# EasyEDA Pro project ProProject_J-Link OB-RA4M2_20230930_V1.0.epro

# Schematic J-Link OB-RA4M2
Create Date: 2023-09-28; Page Name: P1; Project Name: J-Link OB-RA4M2; Schematic Name: J-Link OB-RA4M2; Update Date: 2023-09-29; Company: 嘉立创EDA; Page Size: A4; Version: V1.0
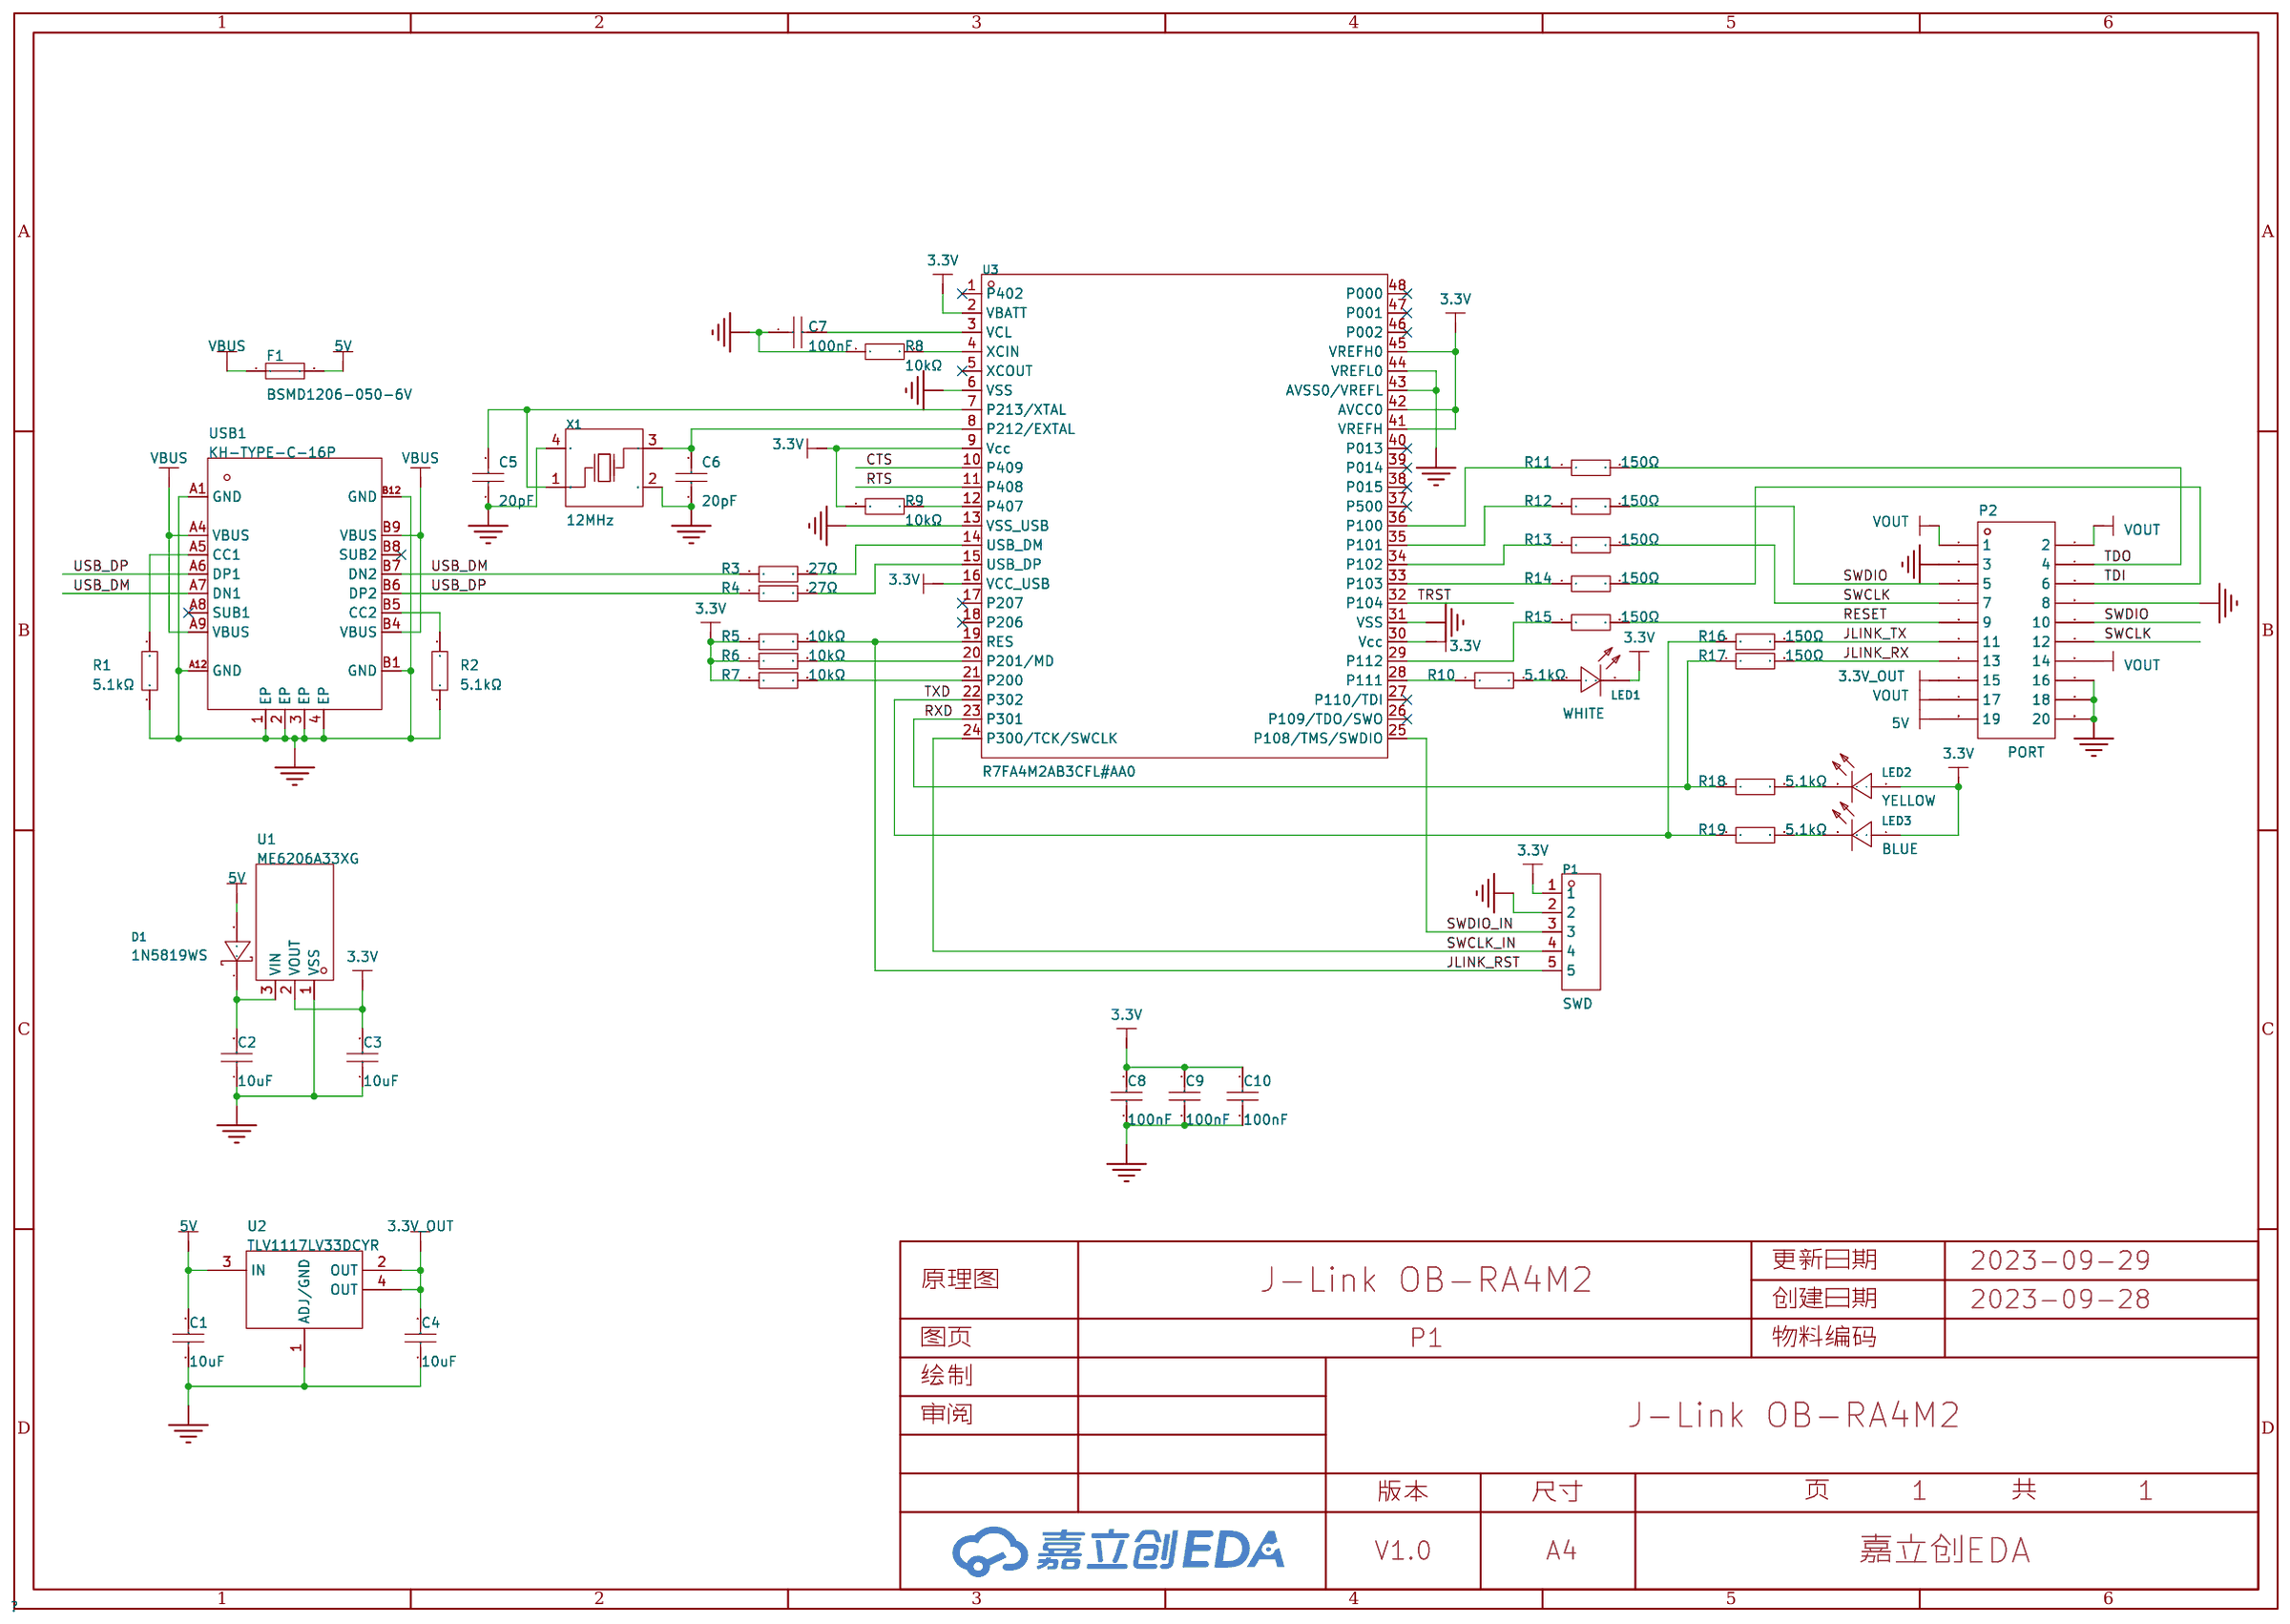
[diagram p0: schematic sheet]

## Parts
C1  10uF  [C0805]
C2  10uF  [C0805]
C3  10uF  [C0805]
C4  10uF  [C0805]
C5  20pF  [C0603]
C6  20pF  [C0603]
C7  100nF  [C0603]
C8  100nF  [C0603]
C9  100nF  [C0603]
C10  100nF  [C0603]
D1  1N5819WS  [SOD-323_L1.8-W1.3-LS2.5-RD]
F1  BSMD1206-050-6V  [F1206]
LED1  WHITE  [LED0603-RD]
LED2  YELLOW  [LED0603-RD-YELLOW]
LED3  BLUE  [LED0603-RD]
P1  SWD  [HDR-TH_5P-P2.54-V-M]
P2  PORT  [HDR-SMD_20P-P2.54]
R1  5.1kΩ  [R0603]
R2  5.1kΩ  [R0603]
R3  27Ω  [R0603]
R4  27Ω  [R0603]
R5  10kΩ  [R0603]
R6  10kΩ  [R0603]
R7  10kΩ  [R0603]
R8  10kΩ  [R0603]
R9  10kΩ  [R0603]
R10  5.1kΩ  [R0603]
R11  150Ω  [R0603]
R12  150Ω  [R0603]
R13  150Ω  [R0603]
R14  150Ω  [R0603]
R15  150Ω  [R0603]
R16  150Ω  [R0603]
R17  150Ω  [R0603]
R18  5.1kΩ  [R0603]
R19  5.1kΩ  [R0603]
U1  ME6206A33XG  [SOT-23-3_L2.9-W1.6-P1.90-LS2.8-BR]
U2  TLV1117LV33DCYR  [SOT-223_L6.7-W3.5-P2.30-BR]
U3  R7FA4M2AB3CFL#AA0  [LQFP-48_L7.0-W7.0-P0.50-LS9.0-BL]
USB1  KH-TYPE-C-16P  [USB-C-SMD_KH-TYPE-C-16P]
X1  12MHz  [OSC-SMD_4P-L3.2-W2.5-BL]

## Library data of the parts
C1-C4 = CL21A106KAYNNNE_C15850: 容值:10uF;精度:±10%;额定电压:25V;材质(温度系数):X5R;; LCSC Part Name: 10uF ±10% 25V; Supplier Part: C15850; Manufacturer: SAMSUNG(三星); Manufacturer Part: CL21A106KAYNNNE; Supplier Footprint: 0805; JLCPCB Part Class: 基础库; Datasheet: https://atta.szlcsc.com/upload/public/pdf/source/20160103/1457707679302.pdf; Supplier: LCSC; Tolerance: ±10%; Voltage Rated: 25V; Temperature Coefficient: X5R
C5 C6 = CL10C200JB8NNNC: 容值:20pF;精度:±5%;额定电压:50V;材质(温度系数):C0G;; LCSC Part Name: 20pF ±5% 50V; Supplier Part: C1648; Manufacturer: SAMSUNG(三星); Supplier Footprint: 0603; JLCPCB Part Class: Basic Part; Datasheet: https://atta.szlcsc.com/upload/public/pdf/source/20160103/1457707686863.pdf; Supplier: LCSC; Tolerance: ±5%; Voltage Rated: 50V; Temperature Coefficient: C0G
C7-C10 = 0603B104K500NT: 容值:100nF;精度:±10%;额定电压:50V;材质(温度系数):X7R;; LCSC Part Name: 100nF ±10% 50V; Supplier Part: C30926; Manufacturer: FH(风华); Supplier Footprint: 0603; JLCPCB Part Class: Extended Part; Datasheet: https://atta.szlcsc.com/upload/public/pdf/source/20170923/C30926_1506149436298988724.pdf; Supplier: LCSC; Tolerance: ±10%; Voltage Rated: 50V; Temperature Coefficient: X7R
D1 = 1N5819WS_C191023: 直流反向耐压(Vr):40V;平均整流电流(Io):1A;正向压降(Vf):600mV@1A;; LCSC Part Name: 40V 1A 600mV@1A; Supplier Part: C191023; Manufacturer: Hottech(合科泰); Supplier Footprint: SOD-323; JLCPCB Part Class: 基础库; Datasheet: https://atta.szlcsc.com/upload/public/pdf/source/20220428/3CB86FD8D28D653594B4E35F9D5AEFD9.pdf; Supplier: LCSC; Reverse Voltage (Vr): 40V; Average Rectified Current (Io): 1A; Forward Voltage (Vf@If): 600mV@1A
F1 = BSMD1206-050-6V: 最大电压:6V;最大电流:100A;保持电流:500mA;跳闸电流:1A;; LCSC Part Name: 6V 500mA 1206自恢复 100毫秒内动作; Supplier Part: C883122; Manufacturer: BHFUSE(佰宏); Supplier Footprint: 1206; JLCPCB Part Class: 扩展库; Datasheet: https://atta.szlcsc.com/upload/public/pdf/source/20220607/BE3D288249A8A8FEF08AA69BF9FC830E.pdf; Supplier: LCSC; Operating Voltage (Max): 6V; Current Rating (Max): 100A; Hold Current: 500mA; Trip Current: 1A; Power Dissipation: 600mW; Resistance - Initial (Ri) (Min): 150mΩ; Resistance - Post Trip (R1) (Max): 700mΩ; Maximum Time to Trip: 100ms; Operating Temperature: -40℃~+85℃
LED1 = 19-217/T1D-CQ2R2TY/3T: 发光颜色:白灯;; LCSC Part Name: 白灯; Supplier Part: C83955; Manufacturer: EVERLIGHT(亿光); Supplier Footprint: 0603; JLCPCB Part Class: Extended Part; Datasheet: https://atta.szlcsc.com/upload/public/pdf/source/20161024/1477288583901.pdf; Supplier: LCSC; Emitted Color: 白灯
LED2 = 19-213/Y2C-CQ2R2L/3T(CY): 发光颜色:黄灯;二极管配置:-;主波长:585.5nm~591.5nm;色温:-;功率:60mW;安装方式:-;; LCSC Part Name: 黄灯; Supplier Part: C72038; Manufacturer: EVERLIGHT(亿光); Supplier Footprint: 0603; JLCPCB Part Class: Basic Part; Datasheet: https://atta.szlcsc.com/upload/public/pdf/source/20160507/1462613613586.pdf; Supplier: LCSC; Emitted Color: 黄灯; Lens Color: 无色透明; Dominant Wavelength: 585.5nm~591.5nm; Peak Wavelength: 591nm; Forward Current: 20mA; Power Dissipation: 60mW; Viewing Angle: 120°; Operating Temperature: -40℃~+85℃
LED3 = 19-217/BHC-XL2M2TY/3T: 发光颜色:蓝灯;; LCSC Part Name: 蓝灯; Supplier Part: C264464; Manufacturer: EVERLIGHT(亿光); Supplier Footprint: 0603; JLCPCB Part Class: Extended Part; Datasheet: https://atta.szlcsc.com/upload/public/pdf/source/20180817/C264464_B6CF2C98FB6ABB846DE0D80D033E0DA6.pdf; Supplier: LCSC; Emitted Color: 蓝灯; Lens Color: 无色透明; Dominant Wavelength: 465nm~475nm; Peak Wavelength: 468nm; Forward Current: 5mA; Power Dissipation: 110mW; Viewing Angle: 120°; Operating Temperature: -40℃~+85℃
P1 = PZ254V-11-05P: 排数:单排;总PIN位数:5P;间距:2.54mm;插针结构:1x5P;行距:-;安装类型:直插;圆针/方针:方针;额定电流:-;额定电压:-;配合针长度:6mm;塑高:2.5mm;端接针长度:3mm;触头材质:黄铜;触头镀层:-;工作温度范围:-40℃~+105℃;颜色:黑色;; LCSC Part Name: 2.54mm 1x5P 直插 方针; Supplier Part: C492404; Manufacturer: XFCN(兴飞); Supplier Footprint: 插件,P=2.54mm; JLCPCB Part Class: Extended Part; Datasheet: https://atta.szlcsc.com/upload/public/pdf/source/20200309/C492404_E51533260F8710EFF5D4617281164C1D.pdf; Supplier: LCSC; Number of Rows: 单排; Number of Pins: 5P; Pitch: 2.54mm; Pin Structure: 1x5P; Mounting Type: 直插; Circluar Pins/Square Pins: 方针; Length of Mating Pin: 6mm; Insulation Height: 2.5mm; Length of End Connection Pin: 3mm; Contact Material: 黄铜; Operating Temperature Range: -40℃~+105℃; Color: 黑色
P2 = HDR2x10_SMD: 间距:2.54mm;总PIN位数:20;排数:2;插针结构:2x10P;行距:2.54mm;安装类型:直插;圆针/方针:-;额定电流:-;额定电压:-;配合针长度:6mm;塑高:2.54mm;端接针长度:3mm;触头材质:黄铜;触头镀层:-;工作温度范围:-40~+105;颜色:黑色;; LCSC Part Name: 2.54mm 2x10P 直插; Supplier Part: C124359; Manufacturer: Ckmtw(灿科盟); Manufacturer Part: B-2100S20P-B110; Supplier Footprint: 插件,P=2.54mm; JLCPCB Part Class: Extended Part; Datasheet: https://atta.szlcsc.com/upload/public/pdf/source/20170821/C124359_1503303298039901511.pdf; Supplier: LCSC; Pitch: 2.54mm; Number of Pins: 20; Number of Rows: 2; Pin Structure: 2x10P; Row Spacing: 2.54mm; Mounting Type: 直插; Length of Mating Pin: 6mm; Insulation Height: 2.54mm; Length of End Connection Pin: 3mm; Contact Material: 黄铜; Operating Temperature Range: -40~+105; Color: 黑色
R1 R2 R10 R18 R19 = 0603WAF5101T5E: 电阻类型:厚膜电阻;阻值:5.1kΩ;精度:±1%;功率:100mW;; LCSC Part Name: 5.1kΩ ±1% 100mW; Supplier Part: C23186; Manufacturer: UNI-ROYAL(厚声); Supplier Footprint: 0603; JLCPCB Part Class: Basic Part; Datasheet: https://atta.szlcsc.com/upload/public/pdf/source/20200306/C422600_1E6D84923E4A46A82E41ADD87F860B5C.pdf; Supplier: LCSC; Type: 厚膜电阻; Tolerance: ±1%; Power(Watts): 100mW; Temperature Coefficient: ±100ppm/℃; Overload Voltage (Max): 75V; Operating Temperature Range: -55℃~+155℃
R3 R4 = 0603WAF270JT5E: 电阻类型:厚膜电阻;阻值:27Ω;精度:±1%;功率:100mW;; LCSC Part Name: 27Ω ±1% 100mW; Supplier Part: C25190; Manufacturer: UNI-ROYAL(厚声); Supplier Footprint: 0603; JLCPCB Part Class: Basic Part; Datasheet: https://atta.szlcsc.com/upload/public/pdf/source/20200306/C422600_1E6D84923E4A46A82E41ADD87F860B5C.pdf; Supplier: LCSC; Type: 厚膜电阻; Tolerance: ±1%; Power(Watts): 100mW; Temperature Coefficient: ±200ppm/℃; Overload Voltage (Max): 75V; Operating Temperature Range: -55℃~+155℃
R5-R9 = 0603WAF1002T5E: 电阻类型:厚膜电阻;阻值:10kΩ;精度:±1%;功率:100mW;; LCSC Part Name: 厚膜电阻 10kΩ ±1% 100mW; Supplier Part: C25804; Manufacturer: UNI-ROYAL(厚声); Supplier Footprint: 0603; JLCPCB Part Class: Basic Part; Datasheet: https://atta.szlcsc.com/upload/public/pdf/source/20200306/C422600_1E6D84923E4A46A82E41ADD87F860B5C.pdf; Supplier: LCSC; Type: 厚膜电阻; Tolerance: ±1%; Power(Watts): 100mW; Temperature Coefficient: ±100ppm/℃; Overload Voltage (Max): 75V; Operating Temperature Range: -55℃~+155℃
R11-R17 = 0603WAF1500T5E: 电阻类型:厚膜电阻;阻值:150Ω;精度:±1%;功率:100mW;; LCSC Part Name: 150Ω ±1% 100mW; Supplier Part: C22808; Manufacturer: UNI-ROYAL(厚声); Supplier Footprint: 0603; JLCPCB Part Class: Basic Part; Datasheet: https://atta.szlcsc.com/upload/public/pdf/source/20200306/C422600_1E6D84923E4A46A82E41ADD87F860B5C.pdf; Supplier: LCSC; Type: 厚膜电阻; Tolerance: ±1%; Power(Watts): 100mW; Temperature Coefficient: ±100ppm/℃; Overload Voltage (Max): 75V; Operating Temperature Range: -55℃~+155℃
U1 = ME6206A33XG: 最大输入电压:6V;压降(max):400mV @ 200mA;输出电压(可调):-;静态电流(Iq):-;输出类型:固定;输出电压(固定):3.3V;; Supplier Part: C161345; Manufacturer: MICRONE(南京微盟); Supplier Footprint: SOT-23(SOT-23-3); JLCPCB Part Class: Extended Part; Datasheet: https://atta.szlcsc.com/upload/public/pdf/source/20180207/C161345_15179949863651359188.pdf; Supplier: LCSC; Voltage - Input (Max): 6V; Voltage Dropout (Max): 400mV @ 200mA; Output Current (Max): 300mA; Output Configuration: 正; Ripple Rejection (PSRR): 50dB(1kHz); Output Type: 固定; Number of Output Channels: 1; Operating Temperature: -25℃~125℃; Voltage - Output (Fixed): 3.3V
U2 = TLV1117LV33DCYR: 输出类型:固定;输出极性:正;最大输入电压:5.5V;输出电压:3.3V;输出电流:1A;电源纹波抑制比(PSRR):75dB@(120Hz);; LCSC Part Name: 输入5.5V 输出3.3V 1A; Supplier Part: C15578; Manufacturer: TI(德州仪器); Supplier Footprint: SOT-223; JLCPCB Part Class: 扩展库; Datasheet: https://atta.szlcsc.com/upload/public/pdf/source/20140704/1457707105729.pdf; Supplier: LCSC; Output Type: 固定; Output Polarity: 正; Number of Outputs: 1; Maximum Input Voltage: 5.5V; Output Voltage: 3.3V; Dropout Voltage: 1.3V@(800mA); Output Current: 1A; Power Supply Rejection Ratio (PSRR): 75dB@(120Hz)
U3 = R7FA4M2AB3CFL#AA0: CPU内核:ARM-M系列;CPU最大主频:100MHz;工作电压范围:2.7V~3.6V;程序存储容量:254KB;GPIO端口数量:30;; Supplier Part: C3230219; Manufacturer: RENESAS(瑞萨)/IDT; Supplier Footprint: LFQFP-48(7x7); JLCPCB Part Class: 扩展库; Supplier: LCSC; CPU Core: ARM-M系列; CPU Maximum Speed: 100MHz; Operating Voltage Range: 2.7V~3.6V; Program Storage Size: 254KB; GPIO Ports Number: 30; ADC (Bit): 12bit; DAC (Bit): 12bit; Universal Serial Bus: 有; Watchdog: 有; Low-Voltage Detect: 有; Direct Memory Access: 有; Internal Oscillator: 有; Operating Temperature Range: -40℃~+105℃
USB1 = KH-TYPE-C-16P: 连接器类型:Type-C;标准:-;公母:母座;触点数量:16;端口数量:1;安装方式:卧贴;额定电流 - 电源:3A;工作温度范围:-40~+85;; LCSC Part Name: Type-C 母座 卧贴; Supplier Part: C709357; Manufacturer: kinghelm(金航标); Supplier Footprint: SMD; JLCPCB Part Class: Extended Part; Datasheet: https://atta.szlcsc.com/upload/public/pdf/source/20200911/C709357_AA8DCEB38BB20E3035A7ED7AE7667837.pdf; Supplier: LCSC; Connector Type: Type-C; Gender: 母座; Number of Contacts: 16; Number of Ports: 1; Mounting Style: 卧贴; Current Rating - Power (Max): 3A; Operating Temperature Range: -40~+85
X1 = X322512MSB4SI: 频率:12MHz;频率公差:±10ppm;负载电容:20pF;; LCSC Part Name: 12MHz ±10ppm 20pF YSX321SL; Supplier Part: C9002; Manufacturer: YXC(扬兴晶振); Supplier Footprint: SMD3225-4P; JLCPCB Part Class: 基础库; Datasheet: https://atta.szlcsc.com/upload/public/pdf/source/20210329/C112971_1F611BDC486E193C1706F6D8EB5AA189.pdf; Supplier: LCSC; Crystal Type: 贴片无源晶振; Frequency Tolerance: ±10ppm; Frequency Stability: ±30ppm; Load Capacitance: 20pF; Operating Temperature: -40℃~+85℃

## Nets
3.3V: C3.2 C8.2 C9.2 C10.2 LED1.2(K) LED2.1(+) LED3.1(A) P1.1 R5.1 R6.1 R7.1 R9.1 U1.2(VOUT) U3.2(VBATT) U3.9(Vcc) U3.16(VCC_USB) U3.30(Vcc) U3.41(VREFH) U3.42(AVCC0) U3.45(VREFH0)
3.3V_OUT: C4.2 P2.15 U2.2(OUT) U2.4(OUT)
5V: C1.2 D1.2(A) F1.2 P2.19 U2.3(IN)
GND: C1.1 C2.1 C3.1 C4.1 C5.1 C6.1 C7.1 C8.1 C9.1 C10.1 P1.2 P2.3 P2.8 P2.16 P2.18 P2.20 R1.1 R2.1 R8.1 U1.1(VSS) U2.1(ADJ/GND) U3.6(VSS) U3.13(VSS_USB) U3.31(VSS) U3.43(AVSS0/VREFL) U3.44(VREFL0) USB1.1(EP) USB1.2(EP) USB1.3(EP) USB1.4(EP) USB1.A1(GND) USB1.A12(GND) USB1.B1(GND) USB1.B12(GND) X1.2(GND) X1.4(GND)
VBUS: F1.1 USB1.A4(VBUS) USB1.A9(VBUS) USB1.B4(VBUS) USB1.B9(VBUS)
CTS: U3.10(P409)
JLINK_RST: P1.5 R5.2 U3.19(RES)
JLINK_RX: P2.13 R17.2
JLINK_TX: P2.11 R16.2
RESET: P2.9 R15.2
RTS: U3.11(P408)
RXD: R17.1 R18.1 U3.23(P301)
SWCLK: P2.7 P2.12 R13.2
SWCLK_IN: P1.4 U3.24(P300/TCK/SWCLK)
SWDIO: P2.5 P2.10 R12.2
SWDIO_IN: P1.3 U3.25(P108/TMS/SWDIO)
TDI: P2.6 R14.2
TDO: P2.4 R11.2
TRST: U3.32(P104)
TXD: R16.1 R19.1 U3.22(P302)
USB_DM: R3.1 USB1.A7(DN1) USB1.B7(DN2)
USB_DP: R4.1 USB1.A6(DP1) USB1.B6(DP2)
VOUT: P2.1 P2.2 P2.14 P2.17
$1N735: R2.2 USB1.B5(CC2)
$1N736: R1.2 USB1.A5(CC1)
$1N3245: C7.2 U3.3(VCL)
$1N3248: R8.2 U3.4(XCIN)
$1N3338: C5.2 U3.7(P213/XTAL) X1.1(OSC1)
$1N3349: C6.2 U3.8(P212/EXTAL) X1.3(OSC2)
$1N3444: R9.2 U3.12(P407)
$1N3469: R3.2 U3.14(USB_DM)
$1N3474: R4.2 U3.15(USB_DP)
$1N3583: R6.2 U3.20(P201/MD)
$1N3586: R7.2 U3.21(P200)
$1N4932: R10.1 U3.28(P111)
$1N4934: LED1.1(A) R10.2
$1N4948: R15.1 U3.29(P112)
$1N5040: R14.1 U3.33(P103)
$1N5043: R13.1 U3.34(P102)
$1N5046: R12.1 U3.35(P101)
$1N5049: R11.1 U3.36(P100)
$1N6219: LED3.2(K) R19.2
$1N6221: LED2.2(-) R18.2
$1N6762: C2.2 D1.1(K) U1.3(VIN)

Not connected (* = marked no-connect by the designer): U3 1(P402)* 5(XCOUT)* 17(P207)* 18(P206)* 26(P109/TDO/SWO)* 27(P110/TDI)* 37(P500)* 38(P015)* 39(P014)* 40(P013)* 46(P002)* 47(P001)* 48(P000)*; USB1 A8(SUB1)* B8(SUB2)*

# Board PCB1
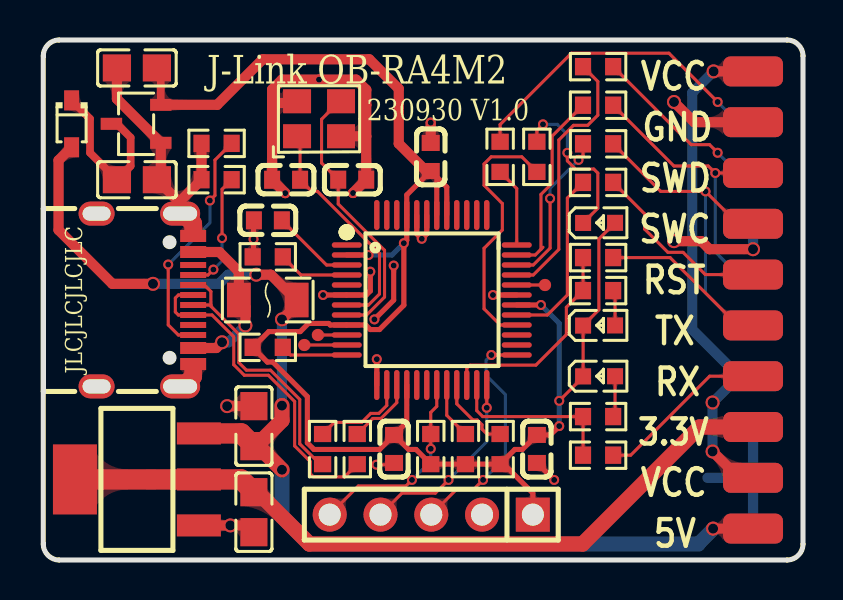
[diagram p1: board, top side]
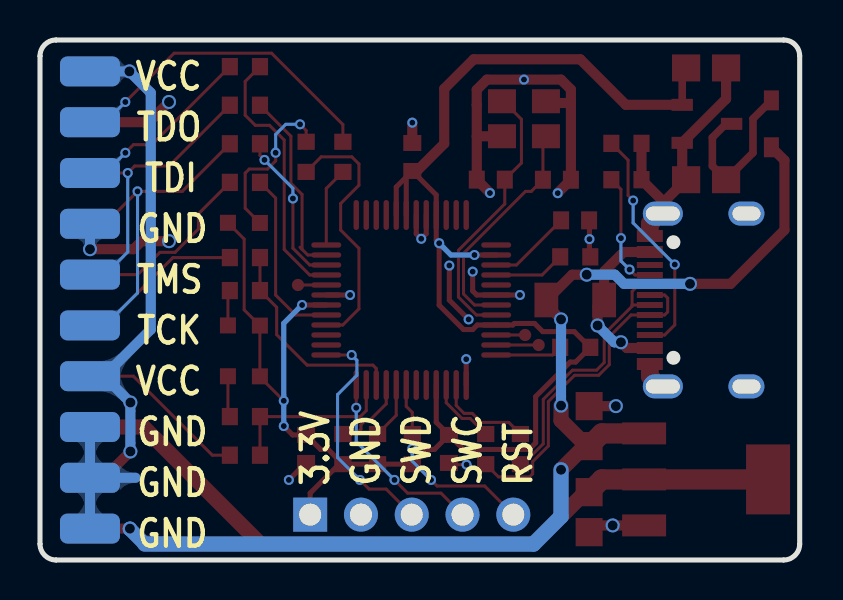
[diagram p2: board, bottom side, seen from below]

Outline 38 x 26 mm; copper layers: Top Layer, Bottom Layer. Coordinates in mm from the lower left corner of the outline.
Outline path: 0,25.2 0,0.8 arc(0.23,0.23) 0.8,0 37.2,0 arc(37.77,0.23) 38,0.8 38,25.2 arc(37.77,25.77) 37.2,26 0.8,26 arc(0.23,25.77) 0,25.2
Stack: Top Layer 0.035mm / Dielectric1 1.51mm FR4 er 4.5 / Bottom Layer 0.035mm

## Design rules (mm)
template: 自定义配置
spacing copperThickness1oz (default): track to track 0.102, other pairs 0.102 to 0.3
spacing copperThickness2oz: track to track 0.203, other pairs 0.152 to 0.3
track width copperThickness1oz (default): min 0.127, default 0.254, max 2.54
track width copperThickness2oz: min 0.203, default 0.254, max 2.54
differential pair differentialPair (default): width min 0.127, default 0.254, max 2.54; gap min 0.152, default 0.152
via viaSize (default): diameter min 0.5, default 0.599, max 10; hole min 0.3, default 0.3, max 6.299

## Placement (name value [footprint] x y rotation side)
C1  10uF  [C0805]  10.53 6.69 270 top
C2  10uF  [C0805]  4.68 19.02 180 top
C3  10uF  [C0805]  4.68 24.6 0 top
C4  10uF  [C0805]  10.53 2.39 90 top
C5  20pF  [C0603]  12.14 19.01 0 top
C6  20pF  [C0603]  15.45 19.02 180 top
C7  100nF  [C0603]  11.23 16.98 0 top
C8  100nF  [C0603]  17.54 5.55 90 top
C9  100nF  [C0603]  24.69 5.55 90 top
C10  100nF  [C0603]  19.38 20.15 270 top
D1  1N5819WS  [SOD-323_L1.8-W1.3-LS2.5-RD]  1.42 21.81 270 top
F1  BSMD1206-050-6V  [F1206]  11.23 13 0 top
LED1  WHITE  [LED0603-RD]  27.8 16.86 0 top
LED2  YELLOW  [LED0603-RD-YELLOW]  27.8 9.18 0 top
LED3  BLUE  [LED0603-RD]  27.8 11.72 0 top
NOREF  -  [Pad_e621]  13.06 10.75 0 top
NOREF#2  -  [Pad_e422]  25.09 13.75 0 top
NOREF#3  -  [Pad_e622]  13.74 11.25 0 top
P1  SWD  [HDR-TH_5P-P2.54-V-M]  19.41 2.27 180 top
P2  PORT  [HDR-SMD_20P-P2.54]  35.5 24.43 0 top
R1  5.1kΩ  [R0603]  8.67 19.02 0 top
R2  5.1kΩ  [R0603]  8.67 20.83 0 top
R3  27Ω  [R0603]  13.97 5.55 90 top
R4  27Ω  [R0603]  15.7 5.55 90 top
R5  10kΩ  [R0603]  19.38 5.55 90 top
R6  10kΩ  [R0603]  21.12 5.55 90 top
R7  10kΩ  [R0603]  22.85 5.55 90 top
R8  10kΩ  [R0603]  11.23 15.16 0 top
R9  10kΩ  [R0603]  11.23 10.63 0 top
R10  5.1kΩ  [R0603]  24.69 20.16 90 top
R11  150Ω  [R0603]  22.85 20.16 90 top
R12  150Ω  [R0603]  27.75 22.74 0 top
R13  150Ω  [R0603]  27.75 20.81 0 top
R14  150Ω  [R0603]  27.75 24.67 0 top
R15  150Ω  [R0603]  27.75 18.88 0 top
R16  150Ω  [R0603]  27.75 15.12 0 top
R17  150Ω  [R0603]  27.75 5.24 0 top
R18  5.1kΩ  [R0603]  27.75 7.17 0 top
R19  5.1kΩ  [R0603]  27.75 13.47 0 top
U1  ME6206A33XG  [SOT-23-3_L2.9-W1.6-P1.90-LS2.8-BR]  4.64 21.81 0 top
U2  TLV1117LV33DCYR  [SOT-223_L6.7-W3.5-P2.30-BR]  4.68 4.03 0 top
U3  R7FA4M2AB3CFL#AA0  [LQFP-48_L7.0-W7.0-P0.50-LS9.0-BL]  19.43 13 270 top
USB1  KH-TYPE-C-16P  [USB-C-SMD_KH-TYPE-C-16P]  5.08 13 270 top
X1  12MHz  [OSC-SMD_4P-L3.2-W2.5-BL]  13.79 22.06 0 top

## Footprints (pads in the part's own frame, mm; a bottom-side part is the same pattern mirrored in y, then rotated)
C0603
  rect 0.8x0.9 smd: 1(-0.7,0) 2(0.7,0)
C0805
  rect 1.41x1.35 smd: 1(-1,0) 2(1,0)
F1206
  rect 1.19x1.728 smd: 1(-1.445,0) 2(1.445,0)
HDR-SMD_20P-P2.54
  rrect 3x1.5 smd: 1(0,0) 3(0,-2.54) 5(0,-5.08) 7(0,-7.62) 9(0,-10.16) 11(0,-12.7) 13(0,-15.24) 15(0,-17.78) 17(0,-20.32) 19(0,-22.86)
  rrect 3x1.5 smd far side: 2(0,0) 4(0,-2.54) 6(0,-5.08) 8(0,-7.62) 10(0,-10.16) 12(0,-12.7) 14(0,-15.24) 16(0,-17.78) 18(0,-20.32) 20(0,-22.86)
HDR-TH_5P-P2.54-V-M
  rect 1.7x1.7 hole 1.1: 1(-5.08,0)
  round 1.7 hole 1.1: 2(-2.54,0) 3(0,0) 4(2.54,0) 5(5.08,0)
LED0603-RD
  rect 0.8x0.8 smd: 1(-0.799,-0.004) 2(0.799,0.004)
LED0603-RD-YELLOW
  rect 0.8x0.8 smd: 1(-0.799,-0.004) 2(0.799,0.004)
LQFP-48_L7.0-W7.0-P0.50-LS9.0-BL
  oval 0.27x1.5 smd: 1(-2.75,-4.25) 2(-2.25,-4.25) 3(-1.75,-4.25) 4(-1.25,-4.25) 5(-0.75,-4.25) 6(-0.25,-4.25) 7(0.25,-4.25) 8(0.75,-4.25) 9(1.25,-4.25) 10(1.75,-4.25) 11(2.25,-4.25) 12(2.75,-4.25) 25(2.75,4.25) 26(2.25,4.25) 27(1.75,4.25) 28(1.25,4.25) 29(0.75,4.25) 30(0.25,4.25) 31(-0.25,4.25) 32(-0.75,4.25) 33(-1.25,4.25) 34(-1.75,4.25) 35(-2.25,4.25) 36(-2.75,4.25)
  oval 1.5x0.27 smd: 13(4.25,-2.75) 14(4.25,-2.25) 15(4.25,-1.75) 16(4.25,-1.25) 17(4.25,-0.75) 18(4.25,-0.25) 19(4.25,0.25) 20(4.25,0.75) 21(4.25,1.25) 22(4.25,1.75) 23(4.25,2.25) 24(4.25,2.75) 37(-4.25,2.75) 38(-4.25,2.25) 39(-4.25,1.75) 40(-4.25,1.25) 41(-4.25,0.75) 42(-4.25,0.25) 43(-4.25,-0.25) 44(-4.25,-0.75) 45(-4.25,-1.25) 46(-4.25,-1.75) 47(-4.25,-2.25) 48(-4.25,-2.75)
OSC-SMD_4P-L3.2-W2.5-BL
  rect 1.4x1.2 smd: 1(-1.1,-0.875) 2(1.1,-0.875) 3(1.1,0.875) 4(-1.1,0.875)
Pad_e422
  round 0.61 smd: TP2(0,0)
Pad_e621
  round 0.61 smd: TP2(0,0)
Pad_e622
  round 0.61 smd: TP2(0,0)
R0603
  rect 0.806x0.864 smd: 1(-0.753,0) 2(0.753,0)
SOD-323_L1.8-W1.3-LS2.5-RD
  rect 1x0.75 smd: 1(-1.173,0) 2(1.173,0)
SOT-23-3_L2.9-W1.6-P1.90-LS2.8-BR
  rect 1.07x0.6 smd: 1(1.235,-0.95) 2(1.235,0.95) 3(-1.235,0)
SOT-223_L6.7-W3.5-P2.30-BR
  rect 2.2x1.1 smd: 1(3.099,-2.3) 2(3.099,0) 3(3.099,2.3)
  rect 2.2x3.5 smd: 4(-3.099,0)
USB-C-SMD_KH-TYPE-C-16P
  oval 1.2x2 hole 0.7x1.7: 1(-4.32,1.765) 2(4.32,1.765)
  oval 1.2x1.8 hole 0.7x1.4: 3(-4.32,-2.415) 4(4.32,-2.415)
  rect 0.3x1.3 smd: A1(-3.35,2.415) A4(-2.55,2.415) A5(-1.25,2.415) A6(-0.25,2.415) A7(0.25,2.415) A8(1.25,2.415) A9(2.55,2.415) A12(3.35,2.415) B1(3.05,2.415) B4(2.25,2.415) B5(1.75,2.415) B6(0.75,2.415) B7(-0.75,2.415) B8(-1.75,2.415) B9(-2.25,2.415) B12(-3.05,2.415)

## Nets
As in the schematic, except:
CTS: NOREF#3.TP2 U3.10
RTS: NOREF.TP2 U3.11
TRST: NOREF#2.TP2 U3.32

Pads without a net: U3 1 5 17 18 26 27 37 38 39 40 46 47 48; USB1 A8 B8

## Via types
v1: diameter 0.5, hole 0.3, Top Layer to Bottom Layer, 37 vias
v2: diameter 0.7, hole 0.5, Top Layer to Bottom Layer, 16 vias

## Routing (per net, layer and track width the routed paths; a pad name or vN(x,y) marks a point on that pad's centre or on a via; arc(x,y) is an arc through that point)
3.3V: length 88
  Top Layer w0.152: LED1.2 27.79,16.05 27.79,12.51 LED3.1 LED2.1 27,9.15 v1(25.81,7.96)
  Top Layer w0.254: 19.68,19.15 20.18,18.65 U3.41 ; 19.68,19.15 U3.42 ; 19.68,19.15 C10.2 18.18,18.25 U3.45 18.18,15.99 v1(18.03,15.84) 18.03,12.74 16.81,11.52 16.36,11.52 16.13,11.75 U3.9 14.35,11.75 14.28,11.83 13.26,11.83 12.85,11.42 11.28,11.42 10.49,10.63 R9.1 11.21,9.9 11.48,9.9 13.21,8.17 13.21,5.86 13.54,5.53 16.82,5.53 C8.2 ; C8.2 18.27,5.53 18.64,5.53 R5.1 R6.1 R7.1 ; C8.2 18.18,6.89 U3.16 ; R7.1 23.59,5.53 23.96,5.53 C9.2 25.36,6.25 v1(25.81,6.7) ; R7.1 23.04,4.79 24.49,3.34 P1.1 ; U3.2 v1(16.27,15.25) ; U3.30 v1(24.89,12.75)
  Top Layer w0.381: C3.2 5.88,24.41 U1.2
  Top Layer w0.508: C10.2 19.15,19.45 17.78,20.82 17.78,23.56 16.31,25.03 10.97,25.03 8.7,22.76 U1.2
  Bottom Layer w0.254: v1(24.89,12.75) 25.81,11.84 v1(25.81,7.96) v1(25.81,6.7) ; v1(16.27,15.25) 17.44,15.25 v1(18.03,15.84)
3.3V_OUT: length 37.7
  Top Layer w0.762: P2.15 32.82,6.65 26.97,0.8 13.31,0.8 10.72,3.39 C4.2
  Top Layer w1.016: C4.2 9.9,4.03 U2.2 U2.4
5V: length 58.1
  Top Layer w0.508: 12.64,13 12.64,12.74 v2(11.94,12.03) ; 12.64,13 F1.2 ; 12.64,13 11.38,14.27 v2(10.65,14.27) ; D1.2 0.76,19.98 0.76,16.5 3.45,13.81 v2(5.49,13.81) ; 33.53,1.57 P2.19
  Top Layer w0.762: v2(11.94,7.72) 11.94,6.98 10.86,5.9 10.86,5.59 ; v2(11.94,4.51) 10.86,5.59 ; 10.86,5.59 10.76,5.69 C1.2 ; 10.86,5.59 10.76,5.49
  Top Layer w1.016: C1.2 9.9,6.33 U2.3
  Bottom Layer w0.508: v2(5.49,13.81) 8.79,13.81 9.25,14.27 v2(10.65,14.27) ; v2(11.94,12.03) v2(11.94,7.72)
  Bottom Layer w0.711: 32.76,0.8 33.5,1.54 v2(33.5,1.57)
  Bottom Layer w0.762: 32.76,0.8 13.32,0.8 11.94,2.17 v2(11.94,4.51)
GND: length 71.3
  Top Layer w0.152: v1(16.66,4.77) 17.46,4.77 C8.1
  Top Layer w0.254: C7.1 10.52,16.96 v1(10.52,16.04) 10.52,15.2 R8.1 ; v1(16.68,10.04) U3.13 ; U3.44 18.68,16.31 v1(18.93,16.06) 19.18,16.31 U3.43 ; C9.1 24.7,4.85 v1(25.55,4) ; v1(13.99,13.25) U3.6 16.16,13.25 16.36,13.45 v1(16.36,14.42) ; v1(17.53,14.72) 17.53,13 v1(16.56,12.03) ; v1(22.49,13.25) U3.31
  Top Layer w0.508: 16.15,21.19 16.15,22.75 16.15,22.75 16.15,23.51 15.65,24.02 v1(13.79,24.02) 11.94,24.02 11.44,23.52 11.44,22.85 ; 16.15,21.19 C6.1 15.49,18.36 v1(15.49,18.35) ; 16.15,21.19 X1.2 ; 11.44,22.85 C5.1 12.1,18.35 v1(12.1,18.34) ; 11.44,22.85 12.6,22.85 X1.4 ; v2(9.19,7.69) C1.1 ; U2.1 v2(9.36,1.73) 10.2,1.73 C4.1 ; v1(19.38,21.87) C10.1 ; 6.84,17.85 6.84,17.95 R1.1 R2.1 ; 6.84,17.85 C2.1 5.88,19.21 U1.1 3.68,23.05 C3.1 ; 6.84,17.85 USB1.1 ; P2.3 32.56,21.89 v2(31.55,22.9) ; v2(31.55,15.94) 32.92,15.94 33.32,15.54 v2(35.5,15.54)
  Top Layer w0.889: USB1.A1 7.5,16.82 6.99,17.32 USB1.1 ; USB1.A12 7.5,9.18 6.99,8.68 USB1.2
  Bottom Layer w0.508: P2.18 33.22,4.11 ; P2.18 P2.16 ; P2.18 P2.20 ; v2(35.5,15.54) P2.8
VBUS: length 9.1
  Top Layer w0.508: 7.15,10.6 8.65,10.6 v2(8.94,10.89) ; v2(10.11,11.72) 10.11,12.67 F1.1 9.78,14.42 8.8,15.4 7.3,15.4
  Bottom Layer w0.508: v2(10.11,11.72) 9.27,10.89 v2(8.94,10.89)
CTS: length 1.4
  Top Layer w0.152: U3.10 NOREF#3.TP2
JLINK_RST: length 10.1
  Top Layer w0.152: U3.19 19.68,7.68 19.38,7.38 v1(19.38,5.56) ; P1.5 15.76,3.7 18.14,3.7 v1(18.44,4)
  Bottom Layer w0.152: v1(18.44,4) 19.38,4.94 v1(19.38,5.56)
JLINK_RX: length 8.6
  Top Layer w0.152: R17.2 29.38,5.24 33.33,9.19 P2.13
JLINK_TX: length 8.4
  Top Layer w0.152: P2.11 34.74,11.73 31.35,15.12 R16.2
RESET: length 9.4
  Top Layer w0.152: R15.2 30.07,17.31 30.07,16.55 31.24,15.38 32,15.38 33.11,14.27 P2.9
RTS: length 2.1
  Top Layer w0.152: U3.11 NOREF.TP2
RXD: length 8.7
  Top Layer w0.152: R17.1 R18.1 21.98,7.17 21.68,7.47 U3.23
SWCLK: length 16.8
  Top Layer w0.152: P2.7 34.74,16.81 v1(33.12,18.43) 30.88,18.43 R13.2
  Bottom Layer w0.152: v1(33.12,18.43) 33.12,13.35 34.74,11.73 P2.12
SWCLK_IN: length 9.7
  Top Layer w0.152: v1(22.18,7.61) U3.24 ; v1(20.27,4) 19.61,3.34 17.94,3.34 P1.4
  Bottom Layer w0.152: v1(22.18,7.61) 22.18,5.92 v1(20.27,4)
SWDIO: length 14.7
  Top Layer w0.152: R12.2 31.54,19.7 33.26,19.7 v1(33.61,19.35) P2.5
  Bottom Layer w0.152: v1(33.61,19.35) 33.61,15.4 34.74,14.27 P2.10
SWDIO_IN: length 11.8
  Top Layer w0.152: U3.25 v1(22.41,10.25) ; P1.3 20.68,3.55 21.54,3.55 v1(22,4)
  Bottom Layer w0.152: v1(22.41,10.25) 22.15,9.99 22.15,9.24 23.11,8.27 23.11,5.12 v1(22,4)
TDI: length 9.2
  Top Layer w0.152: R14.2 32.4,20.77 33.32,20.77 v1(33.73,20.36)
  Bottom Layer w0.152: v1(33.73,20.36) 34.74,19.35 P2.6
TDO: length 16.4
  Top Layer w0.152: R11.2 22.85,21.77 26.42,25.34 31.29,25.34 v1(33.73,22.9)
  Bottom Layer w0.152: P2.4 34.74,21.89 v1(33.73,22.9)
TRST: length 1.4
  Top Layer w0.152: U3.32 NOREF#2.TP2
TXD: length 10.7
  Top Layer w0.152: R16.1 R19.1 26.16,12.64 26.16,11.27 24.64,9.74 21.35,9.74 21.18,9.58 U3.22
USB_DM: length 13.6
  Top Layer w0.152: USB1.B7 8.06,13.75 8.38,13.43 8.38,12.75 ; 8.38,12.75 8.38,12.69 9.78,11.29 9.78,9.87 10.16,9.49 11.37,9.49 12.83,8.03 12.83,5.81 13.84,4.79 R3.1 ; 8.38,12.75 USB1.A7
USB_DP: length 16.9
  Top Layer w0.152: R4.1 15.07,4.16 13.51,4.16 13.36,4.31 13.36,4.91 12.57,5.7 12.57,7.92 11.26,9.24 10.05,9.24 9.53,9.77 9.53,11.16 8.44,12.25 USB1.B6 6.76,12.25 6.6,12.4 6.6,13.1 6.76,13.25 USB1.A6
VOUT: length 28.2
  Top Layer w0.508: v2(33.53,24.43) P2.1 ; v2(33.48,5.43) 34.79,4.11 P2.17
  Bottom Layer w0.508: P2.1 v2(33.53,24.43) 32.46,23.36 32.46,11.52 34.79,9.19 ; 34.79,9.19 P2.14 ; 34.79,9.19 v2(33.48,7.87) v2(33.48,5.43)
$1N735: length 11.8
  Top Layer w0.152: R2.2 8.59,20 8.59,18.23 v1(8.33,17.97) ; USB1.B5 6.75,11.25 6.25,11.75 v1(6.25,14.77)
  Bottom Layer w0.152: v1(6.25,14.77) 8.33,16.86 v1(8.33,17.97)
$1N736: length 6
  Top Layer w0.152: v1(8.51,14.52) 8.24,14.25 USB1.A5 ; R1.2 8.94,18.54 v1(8.94,16.09)
  Bottom Layer w0.152: v1(8.94,16.09) 8.94,14.95 v1(8.51,14.52)
$1N3245: length 4.2
  Top Layer w0.152: C7.2 14.17,14.75 U3.3
$1N3248: length 3.6
  Top Layer w0.152: R8.2 12.89,14.25 U3.4
$1N3338: length 11.6
  Top Layer w0.152: X1.1 12.84,21.04 C5.2 13.43,18.43 13.72,18.43 16.81,15.33 16.81,13.3 16.26,12.75 U3.7
$1N3349: length 13.8
  Top Layer w0.152: U3.8 16.17,12.25 17.07,13.15 17.07,15.48 14.75,17.8 C6.2 13.92,19.85 13.92,22.04 14.82,22.94 X1.3
$1N3444: length 3.4
  Top Layer w0.152: U3.12 12.36,10.25 R9.2
$1N3469: length 4.8
  Top Layer w0.152: U3.14 17.18,7.73 16.79,7.33 16.38,7.33 15.93,6.88 14.55,6.88 13.97,6.3
$1N3474: length 3.5
  Top Layer w0.152: U3.15 17.68,7.87 16.89,7.08 16.48,7.08 15.7,6.3
$1N3583: length 2.8
  Top Layer w0.152: U3.20 20.18,7.23 21.12,6.3
$1N3586: length 3.9
  Top Layer w0.152: U3.21 20.68,7.81 21.49,7 21.7,7 21.95,6.76 21.95,6.54 22.19,6.3 22.85,6.3
$1N4932: length 13.1
  Top Layer w0.152: R10.1 23.93,20.16 22.4,20.16 22.05,19.8 22.05,18.74 22.96,17.82 22.96,16.5 22.05,15.59 22.05,12.56 22.85,11.75 U3.28
$1N4934: length 8.3
  Top Layer w0.152: LED1.1 27.74,17.59 27.74,19.34 27.53,19.55 26.62,19.55 26.21,19.95 v1(26.21,20.36) ; R10.2 24.69,21.48 v1(24.99,21.78)
  Bottom Layer w0.152: v1(24.99,21.78) 25.71,21.78 26.21,21.28 v1(26.21,20.36)
$1N4948: length 8.9
  Top Layer w0.152: U3.29 25.21,12.25 26.21,13.25 26.21,18.1 R15.1
$1N5040: length 13.3
  Top Layer w0.152: U3.33 24.51,14.25 25.78,15.53 25.78,21 26.52,21.73 27.23,21.73 27.74,22.24 27.74,23.93 R14.1
$1N5043: length 7.9
  Top Layer w0.152: R13.1 27,20.23 v1(26.77,20.01) ; v1(25.35,18.08) 25.35,15.59 24.51,14.75 U3.34
  Bottom Layer w0.152: v1(25.35,18.08) 25.35,18.58 v1(26.77,20.01)
$1N5046: length 9.5
  Top Layer w0.152: 24.89,15.53 24.99,15.64 ; 24.89,15.53 24.61,15.25 U3.35 ; 24.89,15.53 24.89,18.28 25.45,18.84 25.45,21.19 R12.1
$1N5049: length 4
  Top Layer w0.152: R11.1 23.68,18.57 U3.36
$1N6219: length 1.8
  Top Layer w0.152: R19.2 28.6,13.37 LED3.2
$1N6221: length 2.1
  Top Layer w0.152: R18.2 28.6,7.27 LED2.2
$1N6762: length 8.5
  Top Layer w0.381: D1.1 2.34,22.06 2.34,20.36 C2.2 4.37,19.7 4.37,21.12 3.68,21.81 3.41,21.81

## Copper pours and planes (outline as drawn; the poured copper is in the pictures)
GND on Bottom Layer: 0,26 33.28,26 33.28,0 0,0

Small or netless copper shapes (teardrops, artwork), in the pictures only: 229 on Top Layer, 53 on Bottom Layer

## Text on the board
Bottom Silkscreen Layer: TDI | GND | TCK | TDO | TMS | VCC | RST | SWC | SWD | 3.3V
Top Silkscreen Layer: 3.3V | SWC | SWD | VCC | GND | RST | 5V | TX | RX | JLCJLCJLCJLC | 230930 V1.0 | J-Link OB-RA4M2
